# Altium schematic sheet Power.SchDoc: Power Management
size A4; DocumentNumber: 1; Revision: 1.0; SheetNumber: 1; SheetTotal: 2
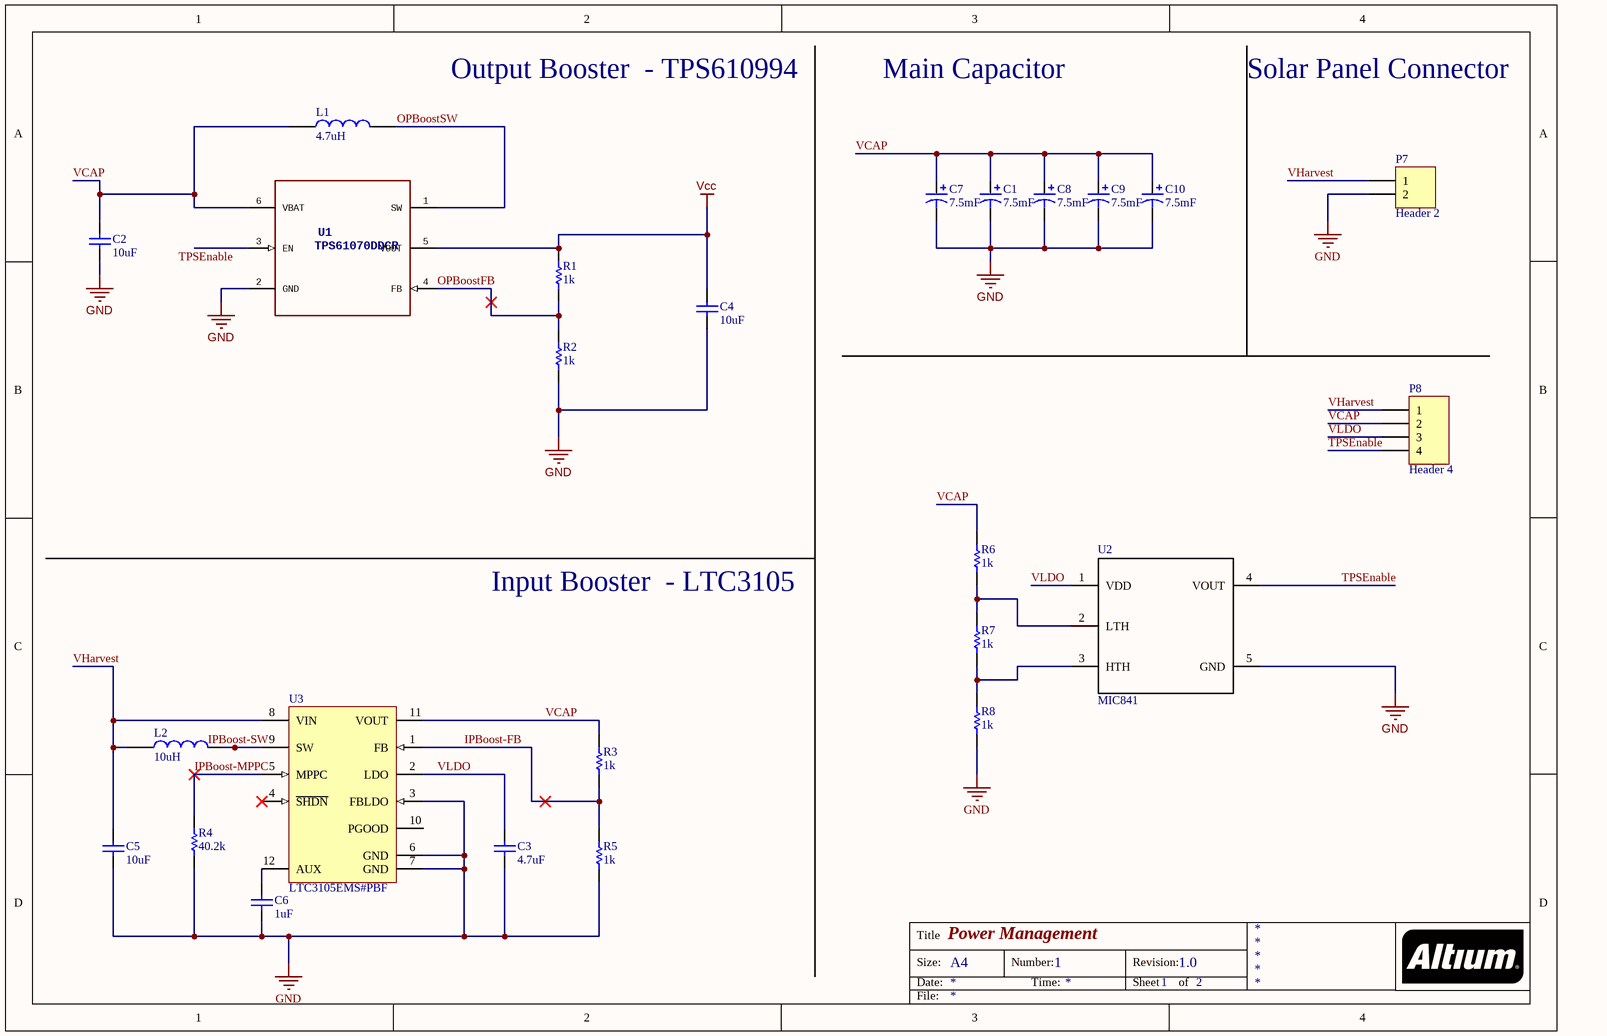
[diagram p0: Power.SchDoc]

## Parts
C1  value 7.5mF  [CAP_CPH3225A]  (hidden comment: Cap - Polarized)
C2  value 10uF  [0805]  (hidden comment: Cap)
C3  value 4.7uF  [0805]  (hidden comment: Cap)
C4  value 10uF  [0805]  (hidden comment: Cap)
C5  value 10uF  [0805]  (hidden comment: Cap)
C6  value 1uF  [0805]  (hidden comment: Cap)
C7  value 7.5mF  [CAP_CPH3225A]  (hidden comment: Cap - Polarized)
C8  value 7.5mF  [CAP_CPH3225A]  (hidden comment: Cap - Polarized)
C9  value 7.5mF  [CAP_CPH3225A]  (hidden comment: Cap - Polarized)
C10  value 7.5mF  [CAP_CPH3225A]  (hidden comment: Cap - Polarized)
L1  value 4.7uH  [1008]  (hidden comment: Ind)
L2  value 10uH  [1008]  (hidden comment: Ind)
P7  Header 2  [HDR1X2]
P8  Header 4  [HDR1X4]
R1  value 1k  [0805]  (hidden comment: Res)
R2  value 1k  [0805]  (hidden comment: Res)
R3  value 1k  [0805]  (hidden comment: Res)
R4  value 40.2k  [0805]  (hidden comment: Res)
R5  value 1k  [0805]  (hidden comment: Res)
R6  value 1k  [0805]  (hidden comment: Res)
R7  value 1k  [0805]  (hidden comment: Res)
R8  value 1k  [0805]  (hidden comment: Res)
U1  TPS61070DDCR  [DDC0006A_N]
U2  MIC841  [SC-70-5]
U3  LTC3105EMS#PBF  [LT-MS-12_N]

## Nets
GND: C1.2 C2.1 C3.1 C4.1 C5.1 C6.1 C7.2 C8.2 C9.2 C10.2 P7.2 R2.1 R4.2 R5.2 R8.1 U1.2(GND) U2.5(GND) U3.3(FBLDO) U3.6(GND) U3.7(GND)
Vcc: C4.2 R1.2 U1.5(VOUT)
IPBoost-FB: R3.2 R5.1 U3.1(FB)
IPBoost-MPPC: R4.1 U3.5(MPPC)
OPBoostFB: R1.1 R2.2 U1.4(FB)
OPBoostSW: L1.2 U1.1(SW)
TPSEnable: P8.4 U1.3(EN) U2.4(VOUT)
VCAP: C1.1 C2.2 C7.1 C8.1 C9.1 C10.1 L1.1 P8.2 R3.1 R6.2 U1.6(VBAT) U3.11(VOUT)
VHarvest: C5.2 L2.1 P7.1 P8.1 U3.8(VIN)
VLDO: C3.2 P8.3 U2.1(VDD) U3.2(LDO)
NetC6_2: C6.2 U3.12(AUX)
NetL2_2: L2.2 U3.9(SW)
NetR6_1: R6.1 R7.2 U2.2(LTH)
NetR7_1: R7.1 R8.2 U2.3(HTH)

Not connected (* = marked no-connect by the designer): U3 4(~{SHDN})* 10(PGOOD)

## Notes on the sheet
- Output Booster  - TPS610994
- Main Capacitor
- Solar Panel Connector
- Input Booster  - LTC3105
- Labels drawn without touching a wire or pin: IPBoost-SW
- Title
- Size:
- Date:
- A4
- Number:
- Time:
- Revision:
- Sheet
- of
- File:

## Library data of the parts
C1 C7-C10 = Cap - Polarized: Polarized Capacitor; Digi-Key Part Number: *; Manufacturer Part Number: *; Manufacturer: *; Rating: *; Note: *
C2-C6 = Cap: Ceramic Capacitor (Surface Mount); Manufacturer: Generic Ceramic Chip Cap (TBD); Digi-Key Part Number: *; Manufacturer Part Number: *; Rating: *; Note: *; Distributor: *; Distributor Part Number: *
L1 L2 = Ind - Power: Power Inductor for DC-DC convters (RF switching freq); Digi-Key Part Number: *; Distributor Part Number: *; Distributor: *; Manufacture Part Number: *; Manufacture: *; Note: *; Rating: *
P7 = Header 2: Header, 2-Pin; LatestRevisionDate: 17-Jul-2002; LatestRevisionNote: Re-released for DXP Platform.; Publisher: Altium Limited
P8 = Header 4: Header, 4-Pin; LatestRevisionDate: 17-Jul-2002; LatestRevisionNote: Re-released for DXP Platform.; Publisher: Altium Limited
R1-R8 = Res: Chip Resistor (Surface Mount); Manufacturer: Generic Chip Res (TBD); Manufacturer Part Number: *; Digi-Key Part Number: *; Rating: *; Note: *
U1 = TPS61070DDCR: MANUFACTURER: Texas Instruments; GateName_1: A; COMPTYPE: IC; PIN_COUNT: 6; SymbolName_1: TPS61070DDC; LibraryName: TPS61070; DeviceSetName: TPS61070DDCR; Package: DDC0006A_N; APPLICATION_BUILDNUMBER: *; MOUNTTYPE: SMT; PACKAGEREFERENCE: DDC0006A; PARTNUMBER: TPS61070DDC; REFDES: RefDes; ROHS: Y; TYPE: TYPE
U3 = CMP-0473-00104-1: 400 mA Step-Up DC/DC Converter with Maximum Power Point Control and 250 mV Start-Up, 12-pin SOP (MS-12), -40 to 85 degC, Pb-Free; Manufacturer: Linear Technology; Number of Outputs: 1; Vin Min(V): 0.225; Topology: Boost; Vin Max(V): 5; Vout Max(V): 5.25; Energy Source: Solar; Mounting Technology: Surface Mount; PackageVersion: Rev. A, 05/2013; PartNumber: LTC3105EMS#PBF; RoHS: TRUE; PackageDescription: 12-Pin Plastic MSOP, Body 4.039 x 3 mm, Pitch 0.65 mm; ComponentLink1Description: Manufacturer URL; DatasheetVersion: Rev. A; ComponentLink1URL: http://www.linear.com/; ComponentLink3Description: Package Specification; ComponentLink2URL: http://cds.linear.com/docs/en/datasheet/3105fa.pdf; ComponentLink3URL: http://cds.linear.com/docs/en/packaging/05081668_A_MS12.pdf; PackageReference: MS-12; ComponentLink2Description: Datasheet
U2 = MIC841: Name: MIC841